# Altium schematic sheet BMS_Battery_Connections.SchDoc
size A4
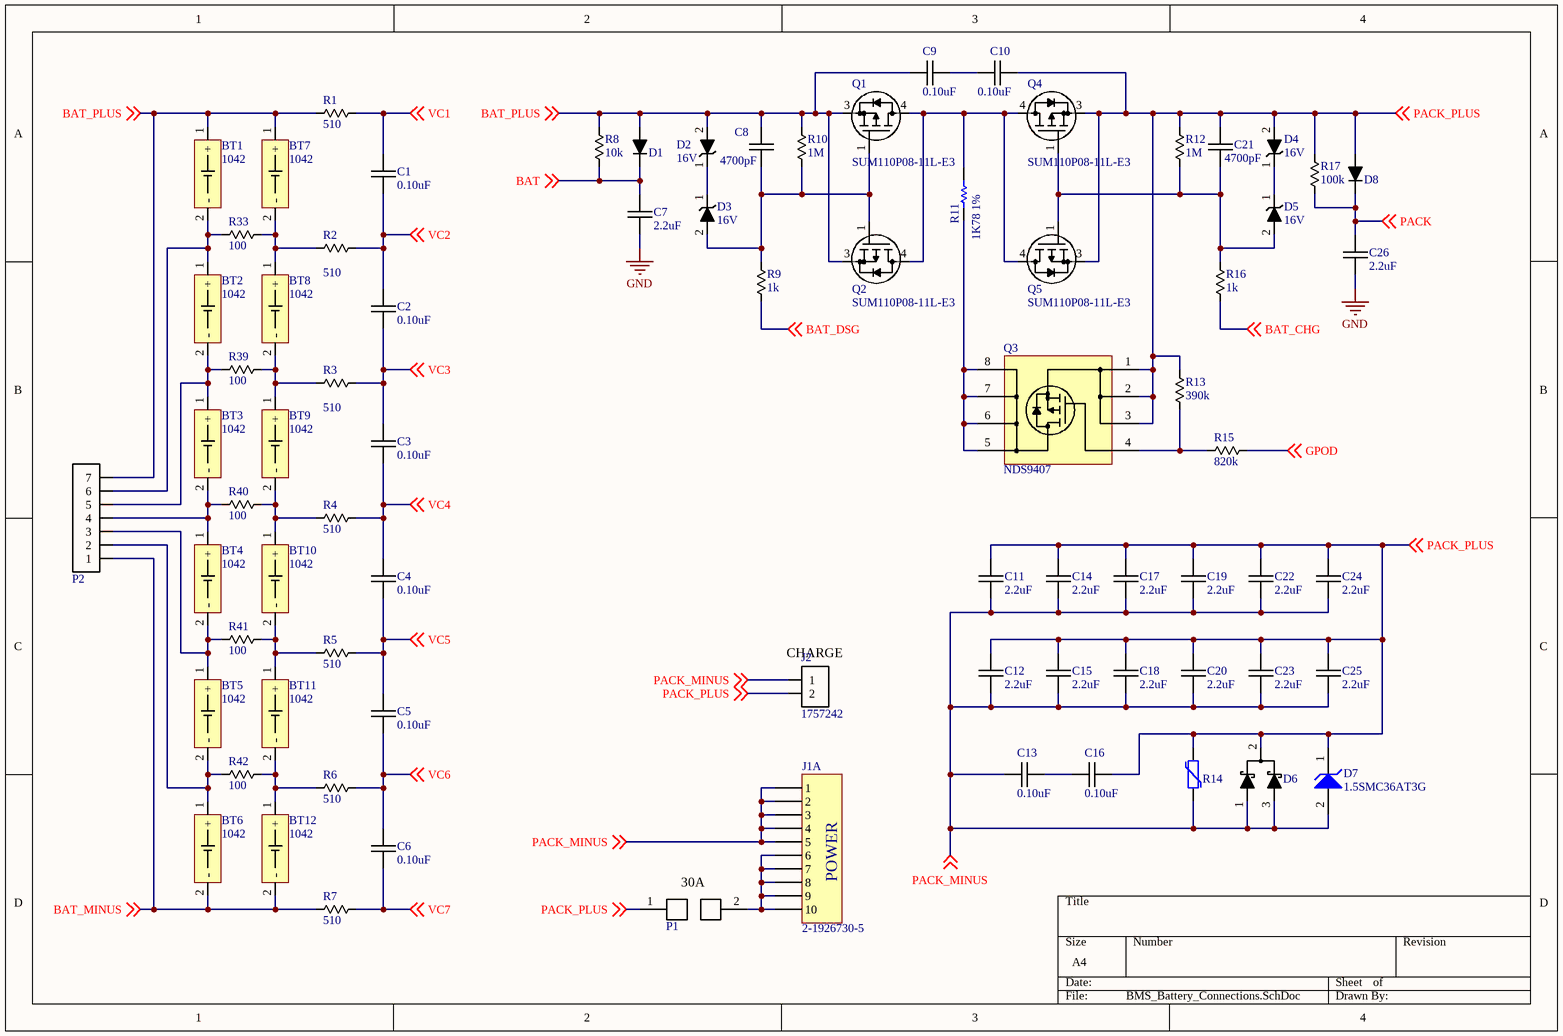
[diagram p0: BMS_Battery_Connections.SchDoc]

## Parts
BT1  1042  [KEYSTONE_1042]
BT2  1042  [KEYSTONE_1042]
BT3  1042  [KEYSTONE_1042]
BT4  1042  [KEYSTONE_1042]
BT5  1042  [KEYSTONE_1042]
BT6  1042  [KEYSTONE_1042]
BT7  1042  [KEYSTONE_1042]
BT8  1042  [KEYSTONE_1042]
BT9  1042  [KEYSTONE_1042]
BT10  1042  [KEYSTONE_1042]
BT11  1042  [KEYSTONE_1042]
BT12  1042  [KEYSTONE_1042]
C1  0.10uF  [chip_0805]
C2  0.10uF  [chip_0805]
C3  0.10uF  [chip_0805]
C4  0.10uF  [chip_0805]
C5  0.10uF  [chip_0805]
C6  0.10uF  [chip_0805]
C7  2.2uF  [chip_1210]
C8  4700pF  [chip_0805]
C9  0.10uF  [chip_0805]
C10  0.10uF  [chip_0805]
C11  2.2uF  [chip_1210]
C12  2.2uF  [chip_1210]
C13  0.10uF  [chip_0805]
C14  2.2uF  [chip_1210]
C15  2.2uF  [chip_1210]
C16  0.10uF  [chip_0805]
C17  2.2uF  [chip_1210]
C18  2.2uF  [chip_1210]
C19  2.2uF  [chip_1210]
C20  2.2uF  [chip_1210]
C21  4700pF  [chip_0805]
C22  2.2uF  [chip_1210]
C23  2.2uF  [chip_1210]
C24  2.2uF  [chip_1210]
C25  2.2uF  [chip_1210]
C26  2.2uF  [chip_1210]
D1  diode_0  [sod123_0]  (value not drawn)
D2  16V  [sod523_0]
D3  16V  [sod523_0]
D4  16V  [sod523_0]
D5  16V  [sod523_0]
D6  V40PWM10C-M3/I  [DPAK_SLIM]  (value not drawn)
D7  1.5SMC36AT3G  [ONSC-SMC-2-403-03_V]
D8  diode_0  [sod123_0]  (value not drawn)
J1  2-1926730-5  [TE_CONN_2-1926730-5]  (part A of 2)
J2  1757242  [PHOENIX_1757242]
P1  conn-fuse-holder_0  [FUSE_HOLDER_KEYSTONE_3557-2]  (value not drawn)
P2  conn-7x1_0  [HDDR_7x1_0]  (value not drawn)
Q1  SUM110P08-11L-E3  [D2PAK-3_1]
Q2  SUM110P08-11L-E3  [D2PAK-3_1]
Q3  NDS9407  [SO-8]
Q4  SUM110P08-11L-E3  [D2PAK-3_1]
Q5  SUM110P08-11L-E3  [D2PAK-3_1]
R1  510  [chip_0805]
R2  510  [chip_0805]
R3  510  [chip_0805]
R4  510  [chip_0805]
R5  510  [chip_0805]
R6  510  [chip_0805]
R7  510  [chip_0805]
R8  10k  [chip_0805]
R9  1k  [chip_0805]
R10  1M  [chip_0805]
R11  1K78 1%  [RESC2512(6432)_L]
R12  1M  [chip_0805]
R13  390k  [chip_0805]
R14  MOV_0  [chip_1210]  (value not drawn)
R15  820k  [chip_0805]
R16  1k  [chip_0805]
R17  100k  [chip_0805]
R33  100  [chip_0805]
R39  100  [chip_0805]
R40  100  [chip_0805]
R41  100  [chip_0805]
R42  100  [chip_0805]

## Nets
GND: C7.2 C26.2
BAT: C7.1 D1.1 R8.2 ; off-sheet BAT
BAT_CHG: R16.2 ; off-sheet BAT_CHG
BAT_DSG: R9.2 ; off-sheet BAT_DSG
BAT_MINUS: BT6.2(-) BT12.2(-) P2.1 R7.1 ; off-sheet BAT_MINUS
BAT_PLUS: BT1.1(+) BT7.1(+) C8.1 C9.1 D1.2 D2.2 P2.7 Q1.3(S) Q2.3(S) R1.1 R8.1 R10.1 ; off-sheet BAT_PLUS
GPOD: R15.2 ; off-sheet GPOD
PACK: C26.1 D8.1 R17.2 ; off-sheet PACK
PACK_MINUS: C11.2 C12.2 C13.2 C14.2 C15.2 C17.2 C18.2 C19.2 C20.2 C22.2 C23.2 C24.2 C25.2 D6.1(A) D6.3(A) D7.2(A) J1.1 J1.2 J1.3 J1.4 J1.5 J2.1 R14.1 ; off-sheet PACK_MINUS
PACK_PLUS: C10.2 C11.1 C12.1 C14.1 C15.1 C16.1 C17.1 C18.1 C19.1 C20.1 C21.1 C22.1 C23.1 C24.1 C25.1 D4.2 D6.2(K) D7.1(K) D8.2 J2.2 P1.1 Q3.1(S) Q3.2(S) Q3.3(S) Q4.3(S) Q5.3(S) R12.1 R13.1 R14.2 R17.1 ; off-sheet PACK_PLUS
VC1: C1.1 R1.2 ; off-sheet VC1
VC2: C1.2 C2.1 R2.2 ; off-sheet VC2
VC3: C2.2 C3.1 R3.2 ; off-sheet VC3
VC4: C3.2 C4.1 R4.2 ; off-sheet VC4
VC5: C4.2 C5.1 R5.2 ; off-sheet VC5
VC6: C5.2 C6.1 R6.2 ; off-sheet VC6
VC7: C6.2 R7.2 ; off-sheet VC7
NetBT1_2: BT1.2(-) BT2.1(+) P2.6 R33.1
NetBT2_2: BT2.2(-) BT3.1(+) P2.5 R39.1
NetBT3_2: BT3.2(-) BT4.1(+) P2.4 R40.1
NetBT4_2: BT4.2(-) BT5.1(+) P2.3 R41.1
NetBT5_2: BT5.2(-) BT6.1(+) P2.2 R42.1
NetBT7_2: BT7.2(-) BT8.1(+) R2.1 R33.2
NetBT8_2: BT8.2(-) BT9.1(+) R3.1 R39.2
NetBT9_2: BT9.2(-) BT10.1(+) R4.1 R40.2
NetBT10_2: BT10.2(-) BT11.1(+) R5.1 R41.2
NetBT11_2: BT11.2(-) BT12.1(+) R6.1 R42.2
NetC8_2: C8.2 D3.2 Q1.1(G) Q2.1(G) R9.1 R10.2
NetC9_2: C9.2 C10.1
NetC13_1: C13.1 C16.2
NetC21_2: C21.2 D5.2 Q4.1(G) Q5.1(G) R12.2 R16.1
NetD2_1: D2.1 D3.1
NetD4_1: D4.1 D5.1
NetJ1_6: J1.6 J1.7 J1.8 J1.9 J1.10 P1.2
NetQ1_4: Q1.4(D) Q2.4(D) Q4.4(D) Q5.4(D) R11.2
NetQ3_4: Q3.4(G) R13.2 R15.1
NetQ3_5: Q3.5(D) Q3.6(D) Q3.7(D) Q3.8(D) R11.1

## Notes on the sheet
- (near J2) CHARGE
- (near P1) 30A
- (in symbol CONN-00093, part A) POWER

## Library data of the parts
BT1-BT12 = CONN-00077: Battery Holder, 18650, SMD; Manufacturer: Keystone; Positions per level: 2; Levels: 1; Part Number: CONN-00077; Type: Battery Holder; Manufacturer PN: 1042; Cost: 2.76
C1-C6 C9 C10 C13 C16 = CAP-00072: CAP, 0.10uF, 10%, 50V, X7R, 0805; Manufacturer: Murata; Manufacturer PN: GRM21BR71H104KA01K; Part Number: CAP-00072; Capacitance: 0.10uF; Tolerance: 10%; Voltage Rating: 50V; Type: X7R
C7 C11 C12 C14 C15 C17-C20 C22-C26 = CAP-00536: CAP, 2.2uF, ±20%, 100V, X7R, 0603; Manufacturer: TDK; Manufacturer PN: C3225X7R2A225M230AB; Part Number: CAP-00536; Capacitance: 2.2uF; Tolerance: ±20%; Voltage Rating: 100V; Type: X7R; Cost: $0.88
C8 C21 = CAP-00032: CAP, 4700pF, 10%, 100V, X7R, 0805; Manufacturer: Murata; Manufacturer PN: GRM219R72A472KA01D; Part Number: CAP-00032; Capacitance: 4700pF; Tolerance: 10%; Voltage Rating: 100V; Type: X7R
D1 D8 = DIO-00060: Dio, Silicon, 200mA, 1V, 100V, SOD-123; Manufacturer: ON Semi; Manufacturer PN: SMMSD4148T3G; Forward Voltage: 1.0V; Part Number: DIO-00060; Reverse Breakdown Voltage: 100V; Current Rating: 200mA; Type: Silicon; Cost: 0.38
D2-D5 = DIO-00082: Dio, Zener, 16V 300mW, SOD-523; Manufacturer: Nexperia; Manufacturer PN: BZX585-C16,115; Forward Voltage: 1.1V; Tolerance: 5%; Current Rating: 100mA; Part Number: DIO-00082; Reverse Breakdown Voltage: 16V; Power Rating: 300mW; Type: Zener; Cost: 0.25
D6 = DIO-00081: Dio, Schottky Array, Dual, Common Cathode, 100V 20A, SLIM DPAK; Manufacturer: Vishay; Forward Voltage: 0.89V; Part Number: DIO-00081; Reverse Breakdown Voltage: 100V; Current Rating: 20A; Type: Schottky; Manufacturer PN: V40PWM10C-M3/I; Cost: 1.37
D7 = CMP-1061-00497-1: 1500 W Peak Power Zener Transient Voltage Suppressor, Unidirectional, 2-Pin SMC, Pb-Free, Tape and Reel; Manufacturer: On Semiconductor; IR Max (uA): 5; PPK Max (W): 1500; V(BR) Typ (V): 36; Direction: Unidirectional; ComponentLink3URL: http://www.onsemi.com/pub_link/Collateral/403-03.PDF; Packing: Tape and Reel; PackageVersion: Rev. E, 08/2005; ComponentLink3Description: Package Specification; RoHS: Pb-Free; ComponentLink2URL: http://www.onsemi.com/pub_link/Collateral/1.5SMC6.8AT3-D.PDF; PackageDescription: 2-Pin Small Molded Package, J-Bend Lead, Body 5.845 x 6.855 mm; ComponentLink2Description: Datasheet; ComponentLink1URL: http://www.onsemi.com/; PackageReference: SMC-2-403-03; DatasheetVersion: Rev. 10; Mounting Technology: Surface Mount; PartNumber: 1.5SMC36AT3G; ComponentLink1Description: Manufacturer URL
J1 = CONN-00093: Backplane Header, Blades and Pins, Edge Mount Right Angle, 10 Power 25 Signal; Manufacturer: TE Connectivity; Positions per level: 35; Levels: 1; Part Number: CONN-00093; Type: Header; Manufacturer PN: 2-1926730-5; Cost: 11.68
J2 = CONN-00102: Terminal Blk Header, 2 Pos, 5.08mm, 12A, Right-Angle; Manufacturer: Phoenix Contact; Positions per level: 2; Levels: 1; Part Number: CONN-00102; Type: Terminal Block; Manufacturer PN: 1757242; Cost: 0.64
P1 = CONN-00015: Fuse Holder, 30A, 500V, LP-Mini 897, ATOF 257; Manufacturer: Keystone Electronics; Manufacturer PN: 3557-2; Positions per level: 2; Levels: 1; Current: 30; Part Number: CONN-00015; Cost: 1.03
P2 = CONN-00105: Header, 7x1, 0.1"; Manufacturer: Samtec; Manufacturer PN: TSW-107-07-F-S; Positions per level: 7; Levels: 1; Part Number: CONN-00105; Type: Header; Cost: 0.61
Q1 Q2 Q4 Q5 = XSTR-00050: XSTR, MOSFET P-Channel, 80V 110A, D2PAK; Manufacturer: Vishay Siliconix; Max Power: 375W; Type: PMOS; Vgs/Vce: 3V; Part Number: XSTR-00050; Max Voltage: 80V; Max Current: 110A; Manufacturer PN: SUM110P08-11L-E3; Cost: 4.43
Q3 = XSTR-00036: XSTR PFET, 3A, 60V, 2.5W, SOIC-8; Manufacturer: ON Semi; Vgs/Vce: 1.6V; Part Number: XSTR-00036; Max Voltage: 60V; Max Current: 3A; Max Power: 2.5W; Type: PFET; Manufacturer PN: NDS9407; Cost: 0.78
R1-R7 = RES-00240: RES SMD 510 OHM 1% 1/8W 0805; Manufacturer: Rohm Semiconductor; Manufacturer PN: KTR10EZPF5100; Power Rating: 0.125W; Part Number: RES-00240; Resistance: 510; Tolerance: 1%
R8 = RES-00307: RES SMD 10K OHM 1% 1/8W 0805; Manufacturer: Rohm Semiconductor; Manufacturer PN: KTR10EZPF1002; Power Rating: 0.125W; Part Number: RES-00307; Resistance: 10k; Tolerance: 1%
R9 R16 = RES-00361: RES SMD 1K OHM 1% 1/8W 0805; Manufacturer: Rohm Semiconductor; Manufacturer PN: KTR10EZPF1001; Power Rating: 0.125W; Part Number: RES-00361; Resistance: 1k; Tolerance: 1%
R10 R12 = RES-00363: RES SMD 1M OHM 1% 1/8W 0805; Manufacturer: Rohm Semiconductor; Manufacturer PN: KTR10EZPF1004; Power Rating: 0.125W; Part Number: RES-00363; Resistance: 1M; Tolerance: 1%
R11 = CMP-1018-00536-1: 1K78 1W 1% 2512 (6432 Metric)  SMD; Case-EIA: 2512; Value: 1780.00 Ohm; Case-Metric: 6432; Tolerance: 1 %; Power: 1 W; Technology: SMT
R13 = RES-00455: RES SMD 390K OHM 1% 1/8W 0805; Manufacturer: Rohm Semiconductor; Manufacturer PN: KTR10EZPF3903; Power Rating: 0.125W; Part Number: RES-00455; Resistance: 390k; Tolerance: 1%
R14 = MISC-00057: Varistor, Ceramic, 47V 300A 2J, 1210; Manufacturer: TDK; Manufacturer PN: B72530T0300K062; Part Number: MISC-00057; Cost: 0.65
R15 = RES-00567: RES SMD 820K OHM 1% 1/8W 0805; Manufacturer: Rohm Semiconductor; Manufacturer PN: KTR10EZPF8203; Power Rating: 0.125W; Part Number: RES-00567; Resistance: 820k; Tolerance: 1%
R17 = RES-00302: RES SMD 100K OHM 1% 1/8W 0805; Manufacturer: Rohm Semiconductor; Manufacturer PN: KTR10EZPF1003; Power Rating: 0.125W; Part Number: RES-00302; Resistance: 100k; Tolerance: 1%
R33 R39-R42 = RES-00179: RES SMD 100 OHM 1% 1/8W 0805; Manufacturer: Rohm Semiconductor; Manufacturer PN: KTR10EZPF1000; Power Rating: 0.125W; Part Number: RES-00179; Resistance: 100; Tolerance: 1%